# Altium schematic sheet TagCheck.SchDoc
size A4; DocumentNumber: 5; SheetNumber: 5; SheetTotal: 10
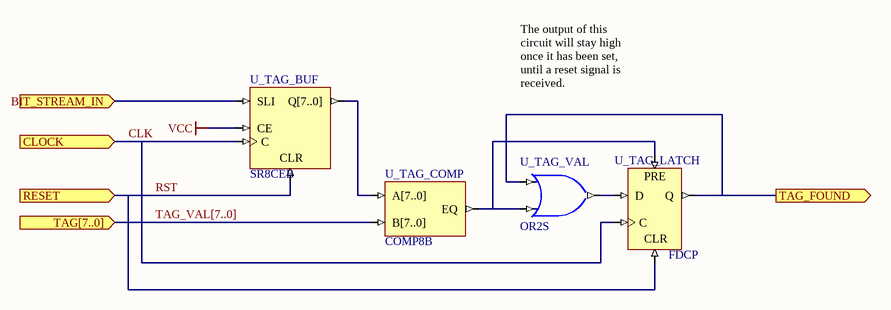
[diagram p0: TagCheck.SchDoc]

## Parts
U_TAG_BUF  SR8CEB
U_TAG_COMP  COMP8B
U_TAG_LATCH  FDCP
U_TAG_VAL  OR2S

## Ports
BIT_STREAM_IN (in), CLOCK (in), RESET (in), TAG[7..0] (in), TAG_FOUND (out)

## Nets
VCC: U_TAG_BUF.CE
BIT_STREAM_IN: U_TAG_BUF.SLI ; port BIT_STREAM_IN
CLK: U_TAG_BUF.C U_TAG_LATCH.C ; port CLOCK
RST: U_TAG_BUF.CLR U_TAG_LATCH.CLR ; port RESET
TAG_FOUND: U_TAG_LATCH.Q U_TAG_VAL.I0 ; port TAG_FOUND
TAG_VAL[7..0]: U_TAG_COMP.B[7..0] ; port TAG[7..0]
NetU_TAG_BUF_Q[7..0]: U_TAG_BUF.Q[7..0] U_TAG_COMP.A[7..0]
NetU_TAG_COMP_EQ: U_TAG_COMP.EQ U_TAG_LATCH.PRE U_TAG_VAL.I1
NetU_TAG_LATCH_D: U_TAG_LATCH.D U_TAG_VAL.O

## Buses and harness runs
bus TAG_VAL[7..0] = port TAG[7..0]

## Notes on the sheet
- The output of this circuit will stay high once it has been set, until a reset signal is received.

## Library data of the parts
U_TAG_BUF = SR8CEB: 8-Bit Serial-In Parallel-Out Shift Registers with Clock Enable and Asynchronous Clear, Bus Version; Xilinx Equivalent: SR8CE; ArchiveName: GENERIC; VHDLIB_SIM: GENERIC_LIB; Published: 29-Jan-2004; Publisher: Altium Limited; Core Revision: 1.00.00
U_TAG_COMP = COMP8B: 8-Bit Identity Comparator, Bus Version; Xilinx Equivalent: COMP8; ArchiveName: GENERIC; VHDLIB_SIM: GENERIC_LIB; Published: 29-Jan-2004; Publisher: Altium Limited; Core Revision: 1.00.00
U_TAG_LATCH = FDCP: D-Type Flip-Flop with Asynchronous Preset and Clear; ArchiveName: GENERIC; VHDLIB_SIM: GENERIC_LIB; Published: 29-Jan-2004; Publisher: Altium Limited; Xilinx Equivalent: FDCP; Core Revision: 1.00.00
U_TAG_VAL = OR2S: 2-Input OR Gate, Single Pin Version; Xilinx Equivalent: OR2; ArchiveName: GENERIC; VHDLIB_SIM: GENERIC_LIB; Published: 29-Jan-2004; Publisher: Altium Limited; Core Revision: 1.00.00